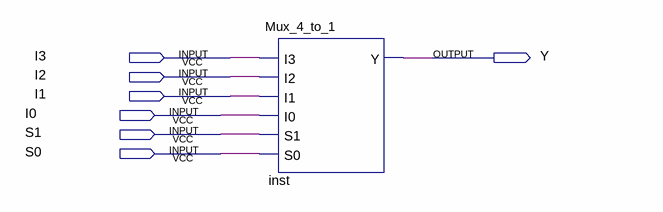
[diagram p0: schematic sheet]
// Quartus schematic Block1.bdf as structural Verilog: 1 symbols, 7 pins
module Block1 (
  input  I3,
  input  I2,
  input  I1,
  input  I0,
  input  S1,
  input  S0,
  output Y
);

  Mux_4_to_1 inst (.I3(I3), .I2(I2), .I1(I1), .I0(I0), .S1(S1), .S0(S0), .Y(Y));
endmodule
